# EAGLE schematic main (EAGLE 7.5.0)
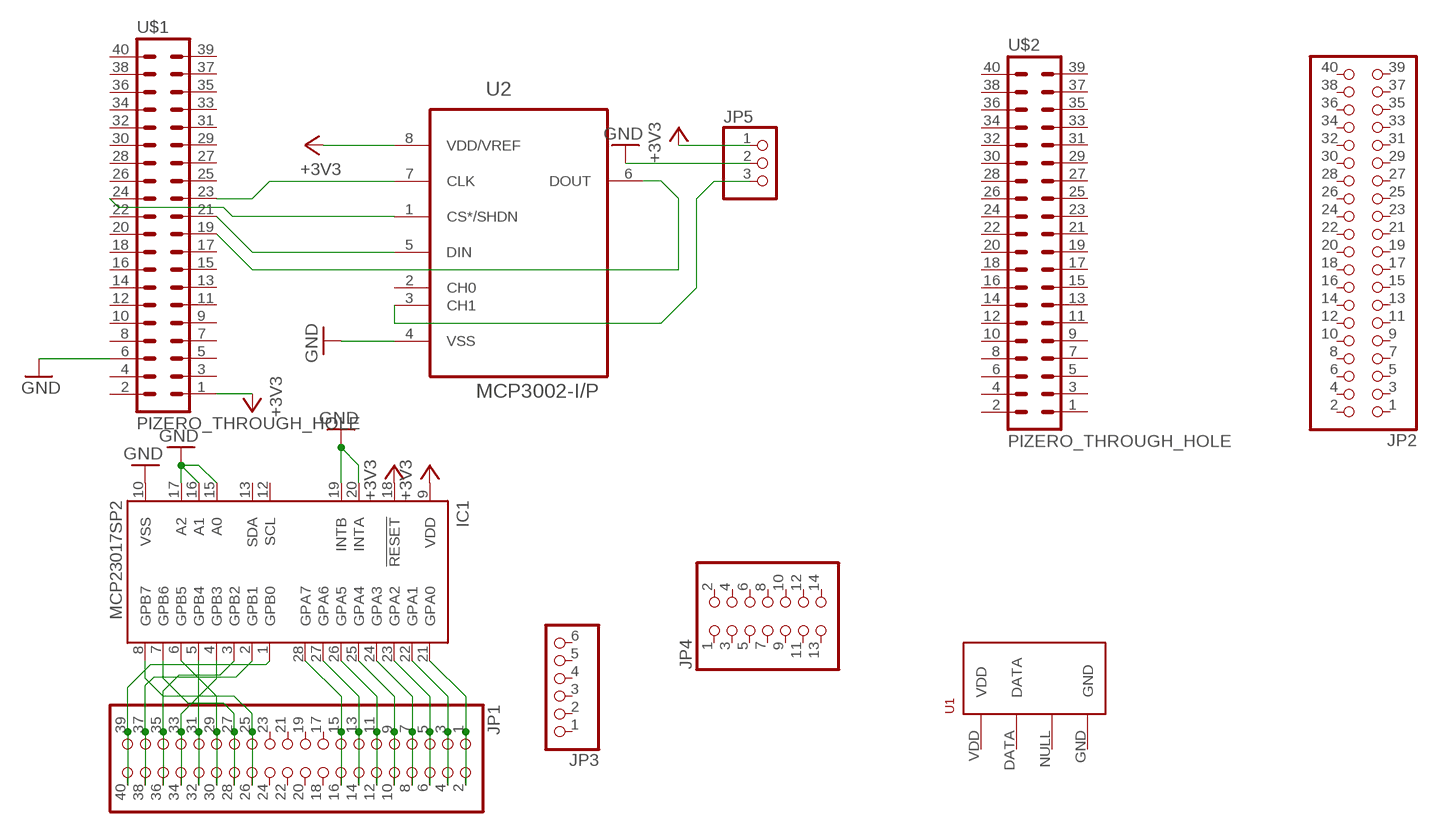
[diagram p0: schematic, sheet 1]

## Parts
IC1  MCP23017SP2  [DIL28-3-ROUND]
JP1  PINHD-2X20  [2X20]
JP2  PINHD-2X20  [2X20]
JP3  PINHD-1X6  [1X06]
JP4  PINHD-2X7  [2X07]
JP5  PINHD-1X3  [1X03]
U1  RHT03_DHT-22_AM2302  [RHT03_DHT-22]
U2  MCP3002-I/P  [DIP254P762X533-8]
U$1  PIZERO_THROUGH_HOLE  [PIZERO_THOUGH_HOLE]
U$2  PIZERO_THROUGH_HOLE  [PIZERO_THOUGH_HOLE]

## Nets
+3V3: IC1.9(VDD) IC1.18(!RESET) JP5.1 U2.8(VDD/VREF) U$1.1
GND: IC1.10(VSS) IC1.15(A0) IC1.16(A1) IC1.17(A2) IC1.19(INTB) IC1.20(INTA) JP5.2 U2.4(VSS) U$1.6
N$1: U2.1(CS*/SHDN) U$1.24
N$2: U2.7(CLK) U$1.23
N$3: U2.5(DIN) U$1.21
N$4: JP5.3 U2.3(CH1)
N$5: U2.6(DOUT) U$1.19
N$7: IC1.1(GPB0) JP1.39 JP1.40
N$8: IC1.2(GPB1) JP1.37 JP1.38
N$9: IC1.3(GPB2) JP1.35 JP1.36
N$10: IC1.4(GPB3) JP1.33 JP1.34
N$11: IC1.5(GPB4) JP1.31 JP1.32
N$12: IC1.6(GPB5) JP1.29 JP1.30
N$13: IC1.7(GPB6) JP1.27 JP1.28
N$14: IC1.8(GPB7) JP1.25 JP1.26
N$15: IC1.21(GPA0) JP1.1 JP1.2
N$16: IC1.22(GPA1) JP1.3 JP1.4
N$17: IC1.23(GPA2) JP1.5 JP1.6
N$18: IC1.24(GPA3) JP1.7 JP1.8
N$19: IC1.25(GPA4) JP1.9 JP1.10
N$20: IC1.26(GPA5) JP1.11 JP1.12
N$21: IC1.27(GPA6) JP1.13 JP1.14
N$22: IC1.28(GPA7) JP1.15 JP1.16
Unconnected: IC1.12(SCL) IC1.13(SDA) JP1.17 JP1.18 JP1.19 JP1.20 JP1.21 JP1.22 JP1.23 JP1.24 JP2.1 JP2.2 JP2.3 JP2.4 JP2.5 JP2.6 JP2.7 JP2.8 JP2.9 JP2.10 JP2.11 JP2.12 JP2.13 JP2.14 JP2.15 JP2.16 JP2.17 JP2.18 JP2.19 JP2.20 JP2.21 JP2.22 JP2.23 JP2.24 JP2.25 JP2.26 JP2.27 JP2.28 JP2.29 JP2.30 JP2.31 JP2.32 JP2.33 JP2.34 JP2.35 JP2.36 JP2.37 JP2.38 JP2.39 JP2.40 JP3.1 JP3.2 JP3.3 JP3.4 JP3.5 JP3.6 JP4.1 JP4.2 JP4.3 JP4.4 JP4.5 JP4.6 JP4.7 JP4.8 JP4.9 JP4.10 JP4.11 JP4.12 JP4.13 JP4.14 U1.DATA U1.NULL U2.2(CH0) U$1.2 U$1.3 U$1.4 U$1.5 U$1.7 U$1.8 U$1.9 U$1.10 U$1.11 U$1.12 U$1.13 U$1.14 U$1.15 U$1.16 U$1.17 U$1.18 U$1.20 U$1.22 U$1.25 U$1.26 U$1.27 U$1.28 U$1.29 U$1.30 U$1.31 U$1.32 U$1.33 U$1.34 U$1.35 U$1.36 U$1.37 U$1.38 U$1.39 U$1.40 U$2.1 U$2.2 U$2.3 U$2.4 U$2.5 U$2.6 U$2.7 U$2.8 U$2.9 U$2.10 U$2.11 U$2.12 U$2.13 U$2.14 U$2.15 U$2.16 U$2.17 U$2.18 U$2.19 U$2.20 U$2.21 U$2.22 U$2.23 U$2.24 U$2.25 U$2.26 U$2.27 U$2.28 U$2.29 U$2.30 U$2.31 U$2.32 U$2.33 U$2.34 U$2.35 U$2.36 U$2.37 U$2.38 U$2.39 U$2.40

## Power pins joined to a net without a drawn wire
GND: U1.GND
VDD: U1.VDD

## Library data of the parts
IC1 = adafruit:MCP23017: http://ww1.microchip.com/downloads/en/DeviceDoc/21952a.pdf Source: http://ww1.microchip.com/downloads/en/DeviceDoc/21952a.pdf
JP1 JP2 = adafruit:PINHD-2X20: PIN HEADER
JP3 = adafruit:PINHD-1X6: PIN HEADER
JP4 = pinhead:PINHD-2X7: PIN HEADER
JP5 = adafruit:PINHD-1X3: PIN HEADER
U1 = RHT03_DHT-22_AM2302:RHT03_DHT-22_AM2302: RHT03 / DHT-22 / AM2302 Packages and symbol for the RHT03 / DHT-22 relative humidity and temperature sensor. Note: The AM2302 is a wired version of the DHT-22 which typically requires less clearance and is thus provided as a separate package.; PROD_ID: SEN-10167
U2 = mcp:MCP3002-I/P: IC, ADC, 10BIT, 200KSPS, DIP-8; MPN: MCP3002-I/P; OC_FARNELL: 1852015; OC_NEWARK: 61K2948; PACKAGE: DIP-8; SUPPLIER: Microchip
U$1 U$2 = pizero:PIZERO_THROUGH_HOLE